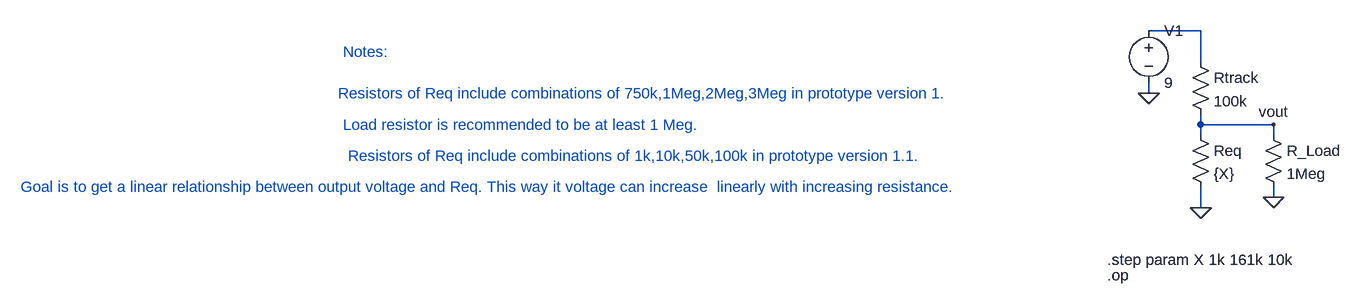
[diagram p0: schematic ltspice-sim-with-load.asc]
ltspice-sim-with-load.asc, the LTspice schematic file:
Version 4
SHEET 1 880 680
WIRE 48 -16 -32 -16
WIRE 48 32 48 -16
WIRE -32 80 -32 64
WIRE 48 128 48 112
WIRE 160 128 48 128
WIRE 48 144 48 128
WIRE 160 144 160 128
WIRE 160 240 160 224
WIRE 48 256 48 224
FLAG 48 256 0
FLAG -32 80 0
FLAG 160 240 0
FLAG 160 128 vout
SYMBOL res 32 128 R0
SYMATTR InstName Req
SYMATTR Value {X}
SYMBOL res 32 16 R0
SYMATTR InstName Rtrack
SYMATTR Value 100k
SYMBOL voltage -32 -32 R0
WINDOW 123 0 0 Left 0
WINDOW 39 0 0 Left 0
SYMATTR InstName V1
SYMATTR Value 9
SYMBOL res 144 128 R0
SYMATTR InstName R_Load
SYMATTR Value 1Meg
TEXT -96 336 Left 2 !.step param X 1k 161k 10k
TEXT -96 360 Left 2 !.op
TEXT -1280 80 Left 2 ;Resistors of Req include combinations of 750k,1Meg,2Meg,3Meg in prototype version 1.
TEXT -1272 16 Left 2 ;Notes:
TEXT -1272 128 Left 2 ;Load resistor is recommended to be at least 1 Meg.
TEXT -1264 176 Left 2 ;Resistors of Req include combinations of 1k,10k,50k,100k in prototype version 1.1.
TEXT -1768 224 Left 2 ;Goal is to get a linear relationship between output voltage and Req. This way it voltage can increase  linearly with increasing resistance.

The netlist it stands for:
* ltspice-sim-with-load.asc
Req vout 0 {X}
Rtrack N001 vout 100k
V1 N001 0 9
R_Load vout 0 1Meg
.step param X 1k 161k 10k
.op
* Resistors of Req include combinations of 750k,1Meg,2Meg,3Meg in prototype version 1.
* Notes:
* Load resistor is recommended to be at least 1 Meg.
* Resistors of Req include combinations of 1k,10k,50k,100k in prototype version 1.1.
* Goal is to get a linear relationship between output voltage and Req. This way it voltage can increase  linearly with increasing resistance.
.backanno
.end

* Results of the author's LTspice run, read from the files saved beside the schematic
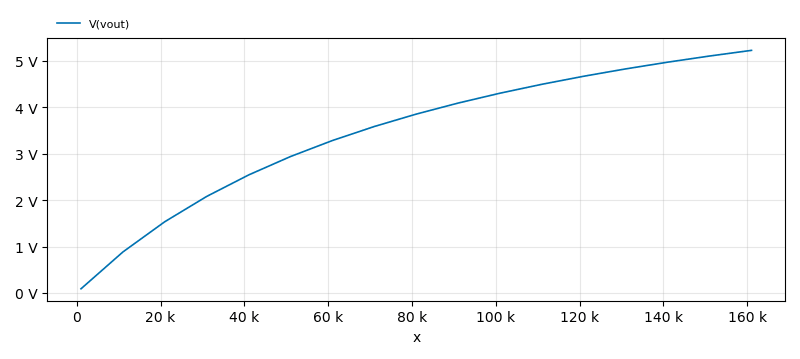
[diagram p1: Operating Point of ltspice-sim-with-load.asc, plotted from the saved traces]
* Operating Point, 1 run:
*   V(vout): 89.02 mV at x=1 k, 5.229 V at x=161 k, min 89.02 mV, max 5.229 V